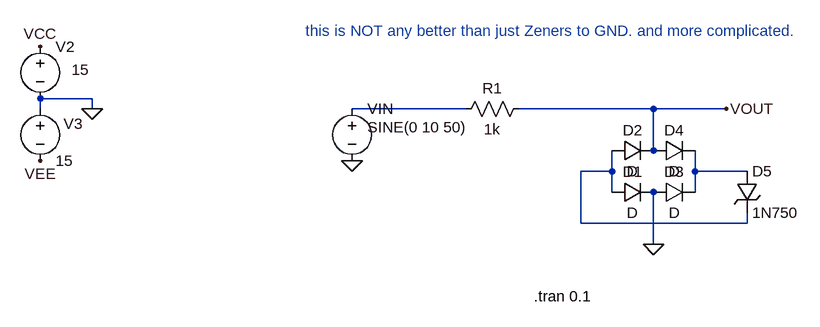
[diagram p0: schematic Draft17.asc]
Draft17.asc, the LTspice schematic file:
Version 4
SHEET 1 936 680
WIRE -640 64 -720 64
WIRE -720 80 -720 64
WIRE -640 80 -640 64
WIRE -64 80 -240 80
WIRE 224 80 16 80
WIRE 336 80 224 80
WIRE 224 144 224 80
WIRE 160 176 160 144
WIRE 160 176 112 176
WIRE 288 176 288 144
WIRE 368 176 288 176
WIRE 160 208 160 176
WIRE 288 208 288 176
WIRE 112 256 112 176
WIRE 368 256 368 240
WIRE 368 256 112 256
WIRE 224 288 224 208
FLAG -640 80 0
FLAG 336 80 VOUT
FLAG -240 160 0
FLAG -720 -16 VCC
FLAG -720 160 VEE
FLAG 224 288 0
SYMBOL voltage -240 64 R0
WINDOW 123 0 0 Left 0
WINDOW 39 0 0 Left 0
WINDOW 3 24 44 Left 2
SYMATTR Value SINE(0 10 50)
SYMATTR InstName VIN
SYMBOL voltage -720 -32 R0
WINDOW 123 0 0 Left 0
WINDOW 39 0 0 Left 0
WINDOW 3 48 52 Left 2
SYMATTR Value 15
SYMATTR InstName V2
SYMBOL voltage -720 64 R0
WINDOW 123 0 0 Left 0
WINDOW 39 0 0 Left 0
WINDOW 0 36 39 Left 2
SYMATTR InstName V3
SYMATTR Value 15
SYMBOL diode 160 224 R270
WINDOW 0 32 32 VTop 2
WINDOW 3 0 32 VBottom 2
SYMATTR InstName D1
SYMBOL diode 160 160 R270
WINDOW 0 32 32 VTop 2
WINDOW 3 0 32 VBottom 2
SYMATTR InstName D2
SYMBOL diode 224 224 R270
WINDOW 0 32 32 VTop 2
WINDOW 3 0 32 VBottom 2
SYMATTR InstName D3
SYMBOL diode 224 160 R270
WINDOW 0 32 32 VTop 2
WINDOW 3 0 32 VBottom 2
SYMATTR InstName D4
SYMBOL zener 352 176 R0
SYMATTR InstName D5
SYMATTR Value 1N750
SYMBOL res 32 64 R90
WINDOW 0 0 56 VBottom 2
WINDOW 3 32 56 VTop 2
SYMATTR InstName R1
SYMATTR Value 1k
TEXT 40 368 Left 2 !.tran 0.1
TEXT -312 -40 Left 2 ;this is NOT any better than just Zeners to GND. and more complicated.

The netlist it stands for:
* Draft17.asc
VIN N001 0 SINE(0 10 50)
V2 VCC 0 15
V3 0 VEE 15
D1 N002 0 D
D2 N002 VOUT D
D3 0 N003 D
D4 VOUT N003 D
D5 N003 N002 1N750
R1 VOUT N001 1k
.model D D
.lib standard.dio
.tran 0.1
* this is NOT any better than just Zeners to GND. and more complicated.
.backanno
.end